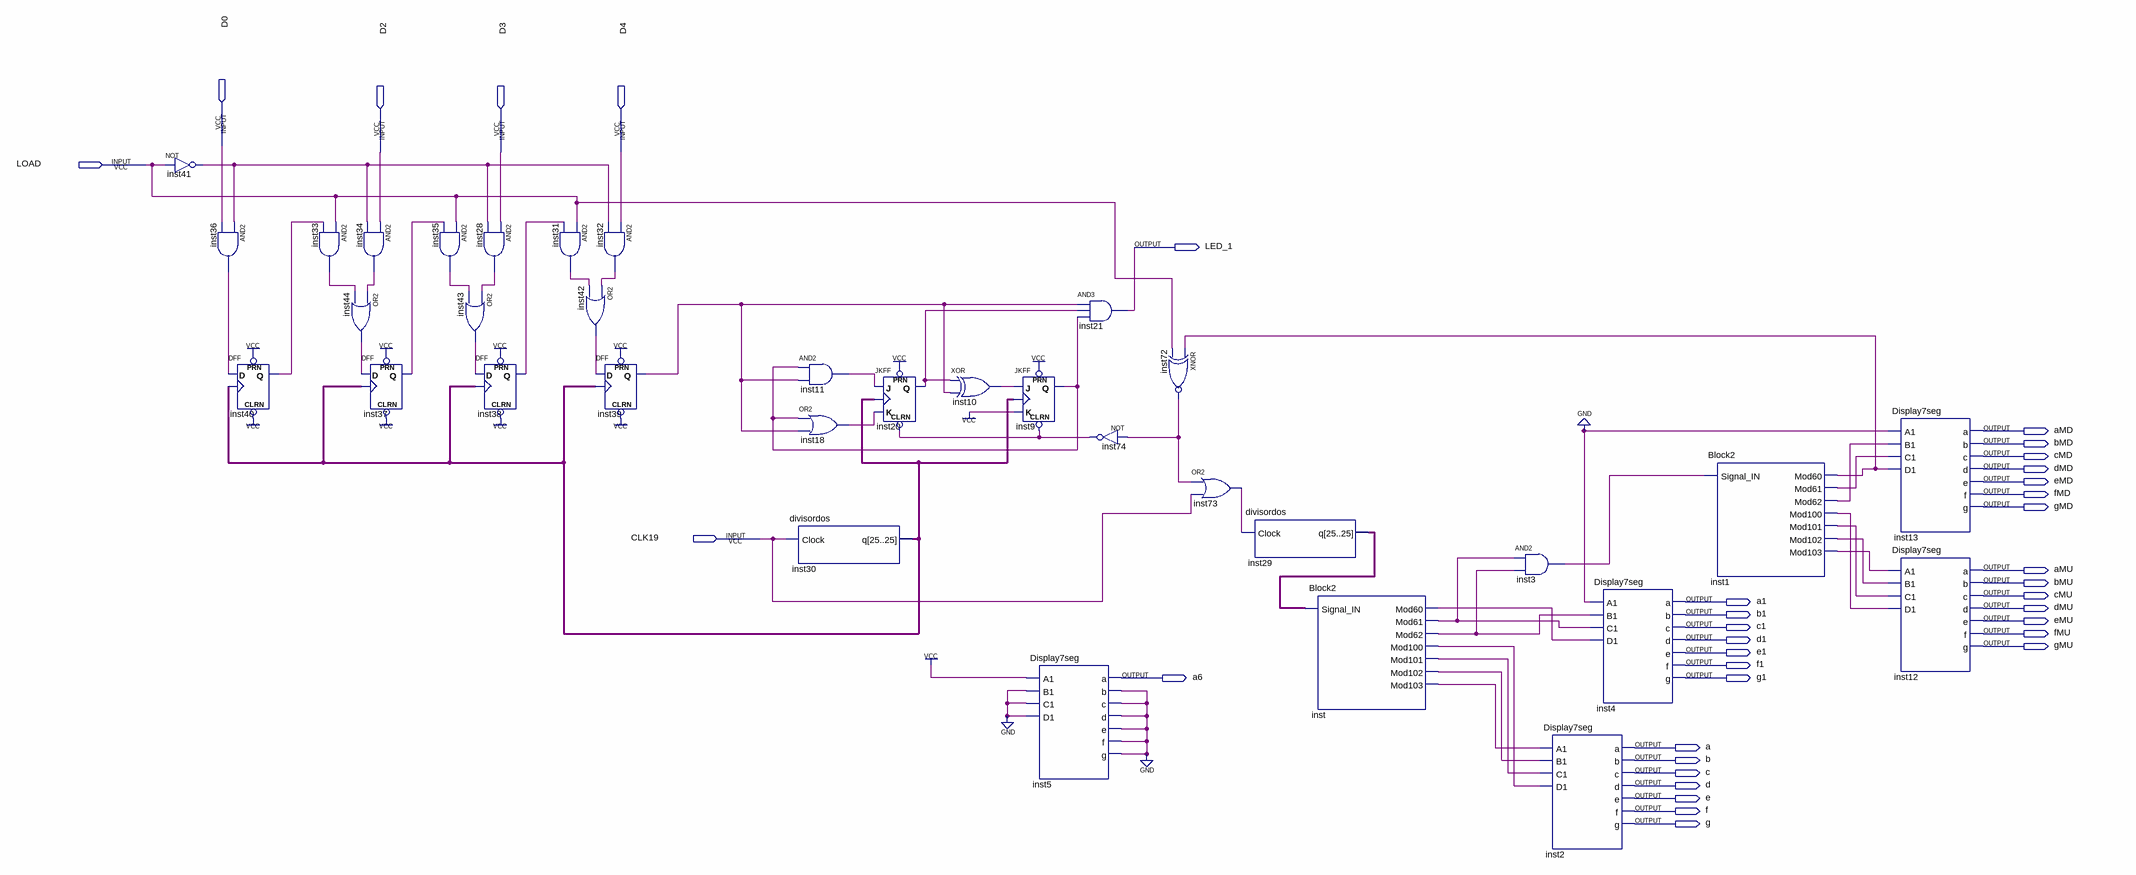
[diagram p0: schematic sheet]
// Quartus schematic Diagrama_RTC_Completo.bdf as structural Verilog: 34 symbols, 36 pins
module Diagrama_RTC_Completo (
  input  D0,
  input  D2,
  input  D3,
  input  D4,
  input  LOAD,
  input  CLK19,
  output LED_1,
  output aMD,
  output bMD,
  output cMD,
  output dMD,
  output eMD,
  output fMD,
  output gMD,
  output aMU,
  output bMU,
  output cMU,
  output a1,
  output dMU,
  output b1,
  output eMU,
  output c1,
  output fMU,
  output d1,
  output gMU,
  output e1,
  output f1,
  output a6,
  output g1,
  output a,
  output b,
  output c,
  output d,
  output e,
  output f,
  output g
);

  wire inst1_mod60, inst1_mod61, inst1_mod62, inst1_mod100, inst1_mod101, inst1_mod102, inst1_mod103,
       inst3_out, inst5_b, inst9_q, inst10_out, inst11_out, inst18_out, inst20_q, inst28_out, inst29_q,
       inst30_q, inst31_out, inst32_out, inst33_out, inst34_out, inst35_out, inst36_out, inst37_q, inst38_q,
       inst39_q, inst40_q, inst41_out, inst42_out, inst43_out, inst44_out, inst72_out, inst73_out,
       inst74_out, inst_mod60, inst_mod61, inst_mod62, inst_mod100, inst_mod101, inst_mod102, inst_mod103;

  not inst41 (inst41_out, LOAD);
  and inst36 (inst36_out, inst41_out, D0);
  DFF inst40 (.CLRN(1'b1), .CLK(inst30_q), .D(inst36_out), .PRN(1'b1), .Q(inst40_q));
  and inst33 (inst33_out, LOAD, inst40_q);
  and inst34 (inst34_out, D2, inst41_out);
  or inst44 (inst44_out, inst34_out, inst33_out);
  DFF inst37 (.CLRN(1'b1), .CLK(inst30_q), .D(inst44_out), .PRN(1'b1), .Q(inst37_q));
  and inst28 (inst28_out, D3, inst41_out);
  and inst35 (inst35_out, LOAD, inst37_q);
  or inst43 (inst43_out, inst28_out, inst35_out);
  DFF inst38 (.CLRN(1'b1), .CLK(inst30_q), .D(inst43_out), .PRN(1'b1), .Q(inst38_q));
  and inst31 (inst31_out, LOAD, inst38_q);
  or inst42 (inst42_out, inst32_out, inst31_out);
  and inst32 (inst32_out, D4, inst41_out);
  DFF inst39 (.CLRN(1'b1), .CLK(inst30_q), .D(inst42_out), .PRN(1'b1), .Q(inst39_q));
  and inst11 (inst11_out, inst9_q, inst39_q);
  or inst18 (inst18_out, inst9_q, inst39_q);
  divisordos inst30 (.Clock(CLK19), .q(inst30_q));
  JKFF inst20 (.PRN(1'b1), .CLRN(inst74_out), .K(inst18_out), .J(inst11_out), .CLK(inst30_q), .Q(inst20_q));
  xor inst10 (inst10_out, inst20_q, inst39_q);
  JKFF inst9 (.PRN(1'b1), .CLRN(inst74_out), .K(1'b1), .J(inst10_out), .CLK(inst30_q), .Q(inst9_q));
  Display7seg inst5 (
    .A1(1'b1), .B1(1'b0), .C1(1'b0), .D1(1'b0), .a(a6), .b(inst5_b), .c(inst5_b), .d(inst5_b), .e(inst5_b),
    .f(inst5_b), .g(inst5_b));
  and inst21 (LED_1, inst39_q, inst20_q, inst9_q);
  not inst74 (inst74_out, inst72_out);
  xnor inst72 (inst72_out, inst1_mod60, LOAD);
  or inst73 (inst73_out, inst72_out, CLK19);
  divisordos inst29 (.Clock(inst73_out), .q(inst29_q));
  Block2 inst (
    .Signal_IN(inst29_q), .Mod60(inst_mod60), .Mod61(inst_mod61), .Mod62(inst_mod62), .Mod100(inst_mod100),
    .Mod101(inst_mod101), .Mod102(inst_mod102), .Mod103(inst_mod103));
  and inst3 (inst3_out, inst_mod61, inst_mod62);
  Display7seg inst2 (
    .A1(inst_mod103), .B1(inst_mod102), .C1(inst_mod101), .D1(inst_mod100), .a(a), .b(b), .c(c), .d(d),
    .e(e), .f(f), .g(g));
  Display7seg inst4 (
    .A1(1'b0), .B1(inst_mod62), .C1(inst_mod61), .D1(inst_mod60), .a(a1), .b(b1), .c(c1), .d(d1), .e(e1),
    .f(f1), .g(g1));
  Block2 inst1 (
    .Signal_IN(inst3_out), .Mod60(inst1_mod60), .Mod61(inst1_mod61), .Mod62(inst1_mod62),
    .Mod100(inst1_mod100), .Mod101(inst1_mod101), .Mod102(inst1_mod102), .Mod103(inst1_mod103));
  Display7seg inst13 (
    .A1(1'b0), .B1(inst1_mod62), .C1(inst1_mod61), .D1(inst1_mod60), .a(aMD), .b(bMD), .c(cMD), .d(dMD),
    .e(eMD), .f(fMD), .g(gMD));
  Display7seg inst12 (
    .A1(inst1_mod103), .B1(inst1_mod102), .C1(inst1_mod101), .D1(inst1_mod100), .a(aMU), .b(bMU), .c(cMU),
    .d(dMU), .e(eMU), .f(fMU), .g(gMU));
  // also tied to GND on the sheet: inst5_b
endmodule
